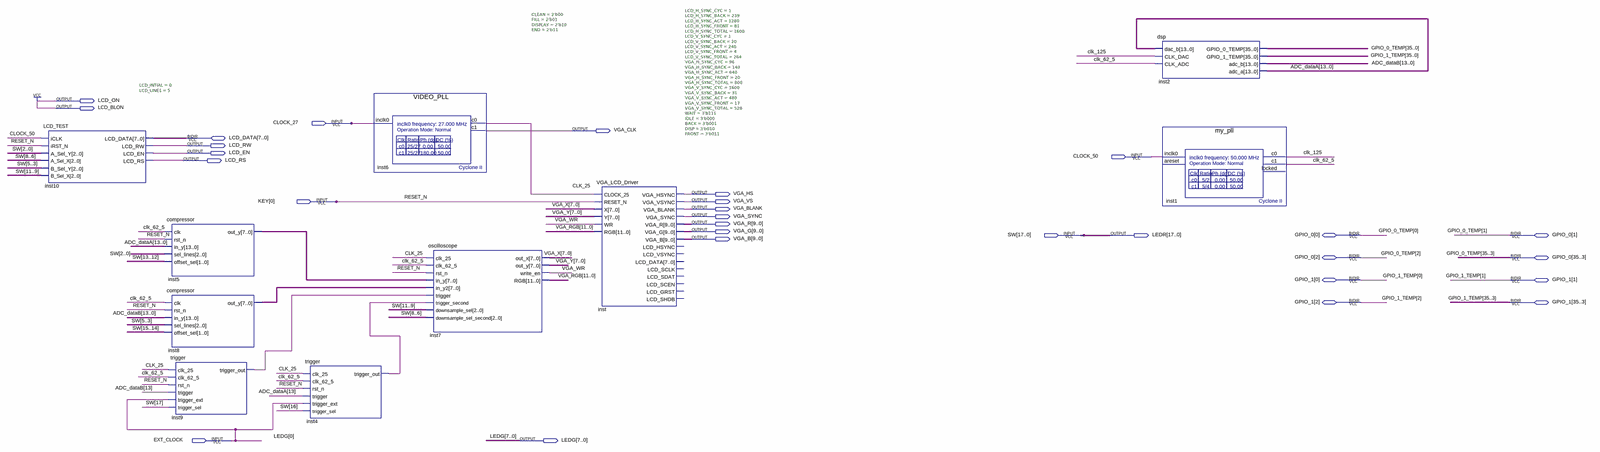
[diagram p0: schematic sheet, whole]
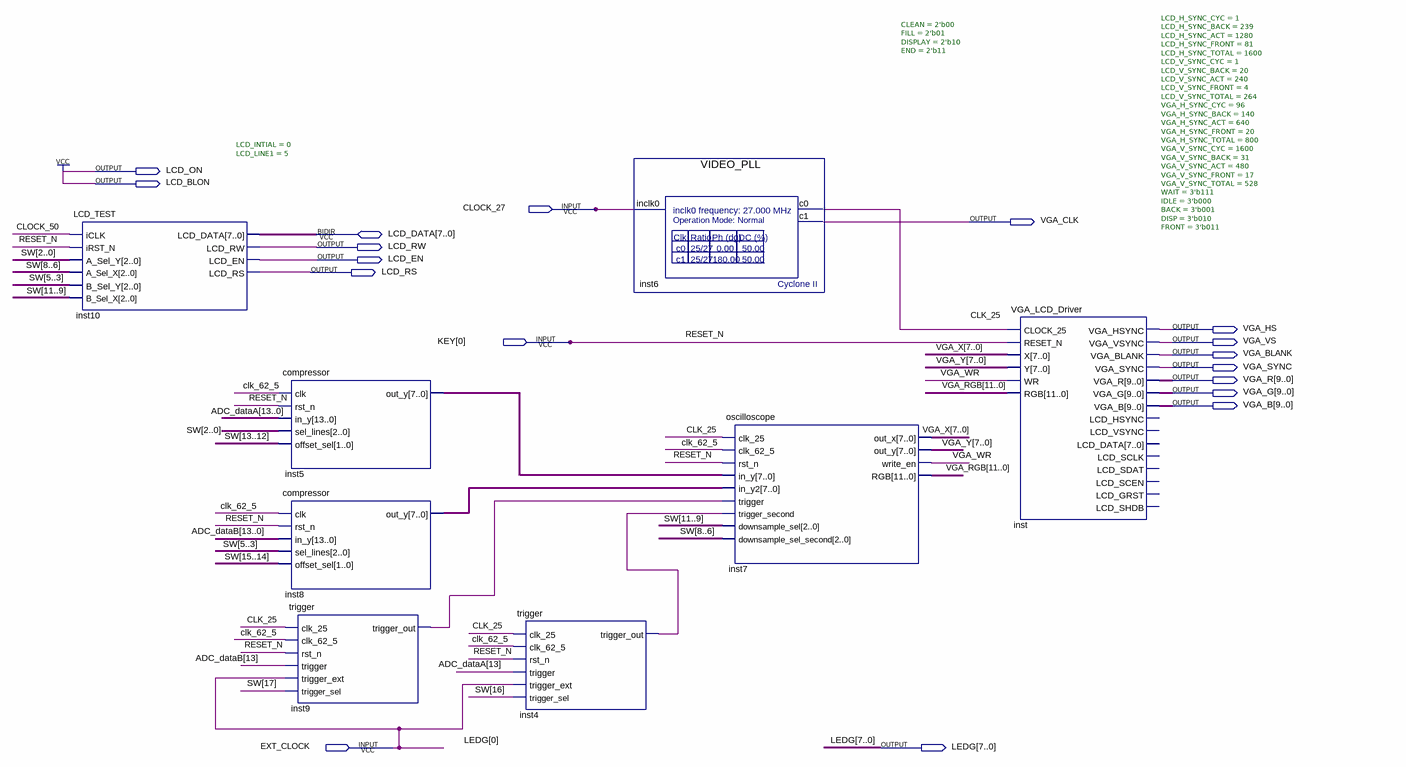
[diagram p1: schematic sheet, left part]
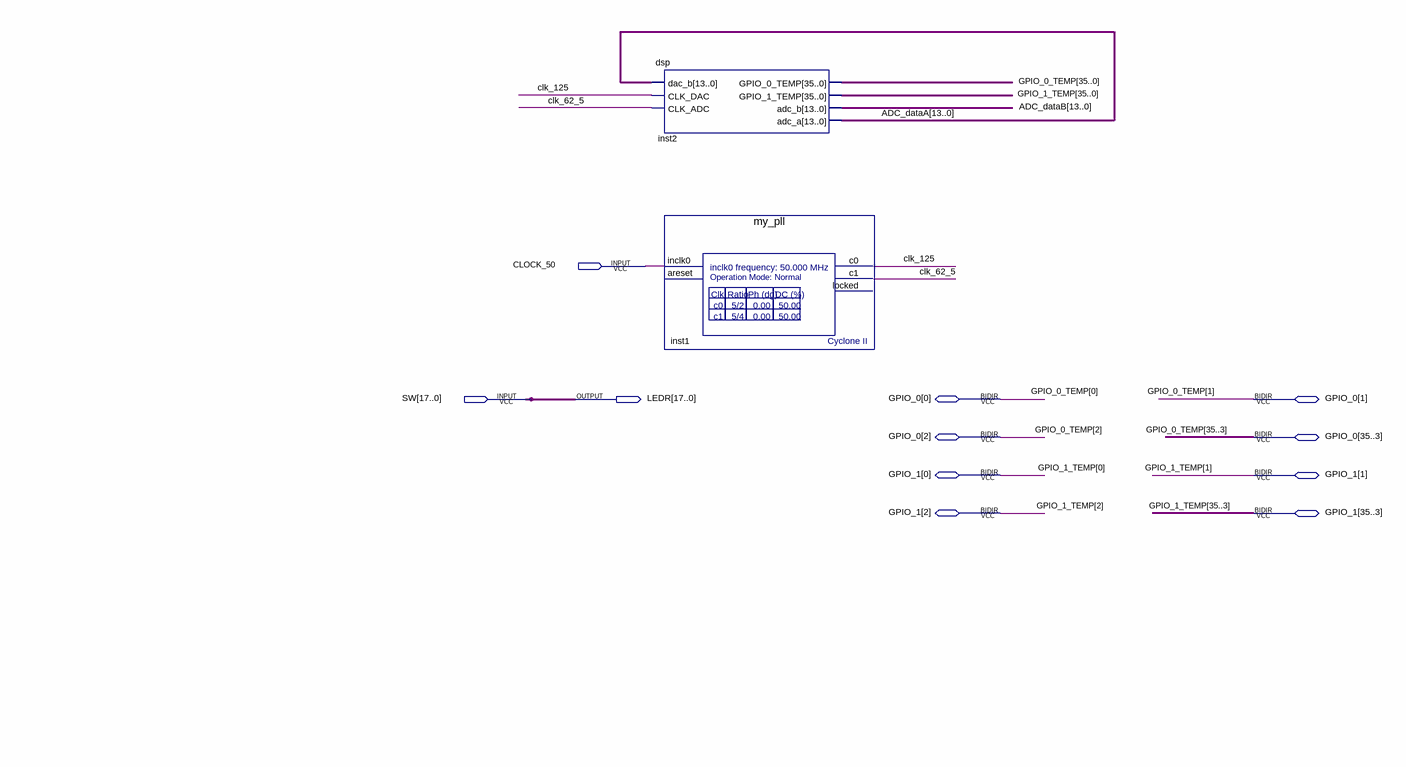
[diagram p2: schematic sheet, right part]
// Quartus schematic LCM_VGA.bdf as structural Verilog: 10 symbols, 29 pins
module LCM_VGA (
  input  CLOCK_27,
  input  CLOCK_50,
  input  [0:0] KEY,
  input  [17:0] SW,
  input  EXT_CLOCK,
  inout  [7:0] LCD_DATA,
  inout  [35:0] GPIO_0,
  inout  [35:0] GPIO_1,
  output LCD_ON,
  output LCD_BLON,
  output VGA_CLK,
  output LCD_RW,
  output LCD_EN,
  output LCD_RS,
  output VGA_HS,
  output VGA_VS,
  output VGA_BLANK,
  output VGA_SYNC,
  output [9:0] VGA_R,
  output [9:0] VGA_G,
  output [17:0] LEDR,
  output [9:0] VGA_B,
  output [7:0] LEDG
);

  wire CLK_25, clk_62_5, clk_125, inst4_trigger_out, inst9_trigger_out, VGA_WR;
  wire [7:0] inst5_out_y, inst8_out_y, VGA_X, VGA_Y;
  wire [11:0] VGA_RGB;
  wire [13:0] ADC_dataA, ADC_dataB;

  LCD_TEST #(.LCD_INTIAL(0), .LCD_LINE1(5)) inst10 (
    .iCLK(CLOCK_50), .iRST_N(KEY[0]), .A_Sel_Y(SW[2:0]), .A_Sel_X(SW[8:6]), .B_Sel_Y(SW[5:3]),
    .B_Sel_X(SW[11:9]), .LCD_DATA(LCD_DATA), .LCD_RW(LCD_RW), .LCD_EN(LCD_EN), .LCD_RS(LCD_RS));
  compressor inst5 (
    .clk(clk_62_5), .rst_n(KEY[0]), .in_y(ADC_dataA), .sel_lines(SW[2:0]), .offset_sel(SW[13:12]),
    .out_y(inst5_out_y));
  compressor inst8 (
    .clk(clk_62_5), .rst_n(KEY[0]), .in_y(ADC_dataB), .sel_lines(SW[5:3]), .offset_sel(SW[15:14]),
    .out_y(inst8_out_y));
  trigger inst9 (
    .clk_25(CLK_25), .clk_62_5(clk_62_5), .rst_n(KEY[0]), .trigger(ADC_dataB[13]), .trigger_ext(EXT_CLOCK),
    .trigger_sel(SW[17]), .trigger_out(inst9_trigger_out));
  trigger inst4 (
    .clk_25(CLK_25), .clk_62_5(clk_62_5), .rst_n(KEY[0]), .trigger(ADC_dataA[13]), .trigger_ext(EXT_CLOCK),
    .trigger_sel(SW[16]), .trigger_out(inst4_trigger_out));
  VIDEO_PLL inst6 (.inclk0(CLOCK_27), .c0(CLK_25), .c1(VGA_CLK));
  oscilloscope #(.CLEAN(2'b00), .FILL(2'b01), .DISPLAY(2'b10), .END(2'b11)) inst7 (
    .clk_25(CLK_25), .clk_62_5(clk_62_5), .rst_n(KEY[0]), .in_y(inst5_out_y), .in_y2(inst8_out_y),
    .trigger(inst9_trigger_out), .trigger_second(inst4_trigger_out), .downsample_sel(SW[11:9]),
    .downsample_sel_second(SW[8:6]), .out_x(VGA_X), .out_y(VGA_Y), .write_en(VGA_WR), .RGB(VGA_RGB));
  VGA_LCD_Driver #(.LCD_H_SYNC_CYC(1), .LCD_H_SYNC_BACK(239), .LCD_H_SYNC_ACT(1280), .LCD_H_SYNC_FRONT(81), .LCD_H_SYNC_TOTAL(1600), .LCD_V_SYNC_CYC(1), .LCD_V_SYNC_BACK(20), .LCD_V_SYNC_ACT(240), .LCD_V_SYNC_FRONT(4), .LCD_V_SYNC_TOTAL(264), .VGA_H_SYNC_CYC(96), .VGA_H_SYNC_BACK(140), .VGA_H_SYNC_ACT(640), .VGA_H_SYNC_FRONT(20), .VGA_H_SYNC_TOTAL(800), .VGA_V_SYNC_CYC(1600), .VGA_V_SYNC_BACK(31), .VGA_V_SYNC_ACT(480), .VGA_V_SYNC_FRONT(17), .VGA_V_SYNC_TOTAL(528), .WAIT(3'b111), .IDLE(3'b000), .BACK(3'b001), .DISP(3'b010), .FRONT(3'b011)) inst (
    .CLOCK_25(CLK_25), .RESET_N(KEY[0]), .X(VGA_X), .Y(VGA_Y), .WR(VGA_WR), .RGB(VGA_RGB),
    .VGA_HSYNC(VGA_HS), .VGA_VSYNC(VGA_VS), .VGA_BLANK(VGA_BLANK), .VGA_SYNC(VGA_SYNC), .VGA_R(VGA_R),
    .VGA_G(VGA_G), .VGA_B(VGA_B));  // open: LCD_HSYNC, LCD_VSYNC, LCD_DATA, LCD_SCLK, LCD_SDAT, LCD_SCEN, LCD_GRST, LCD_SHDB
  dsp inst2 (
    .dac_b(ADC_dataA), .CLK_DAC(clk_125), .CLK_ADC(clk_62_5), .adc_b(ADC_dataB), .adc_a(ADC_dataA),
    .GPIO_0_TEMP(GPIO_0), .GPIO_1_TEMP(GPIO_1));
  my_pll inst1 (.inclk0(CLOCK_50), .c0(clk_125), .c1(clk_62_5));  // open: areset, locked

  assign LCD_BLON = 1'b1;
  assign LCD_ON = 1'b1;
  assign LEDG[0] = EXT_CLOCK;
  assign LEDR = SW;

  // Other names for the same wires on the sheet: GPIO_0_TEMP[35:0] = GPIO_0; GPIO_1_TEMP[35:0] = GPIO_1;
  //   RESET_N = KEY[0]
endmodule
